# Altium schematic sheet 2_Power.SchDoc
size A; SheetNumber: 2; SheetTotal: 6
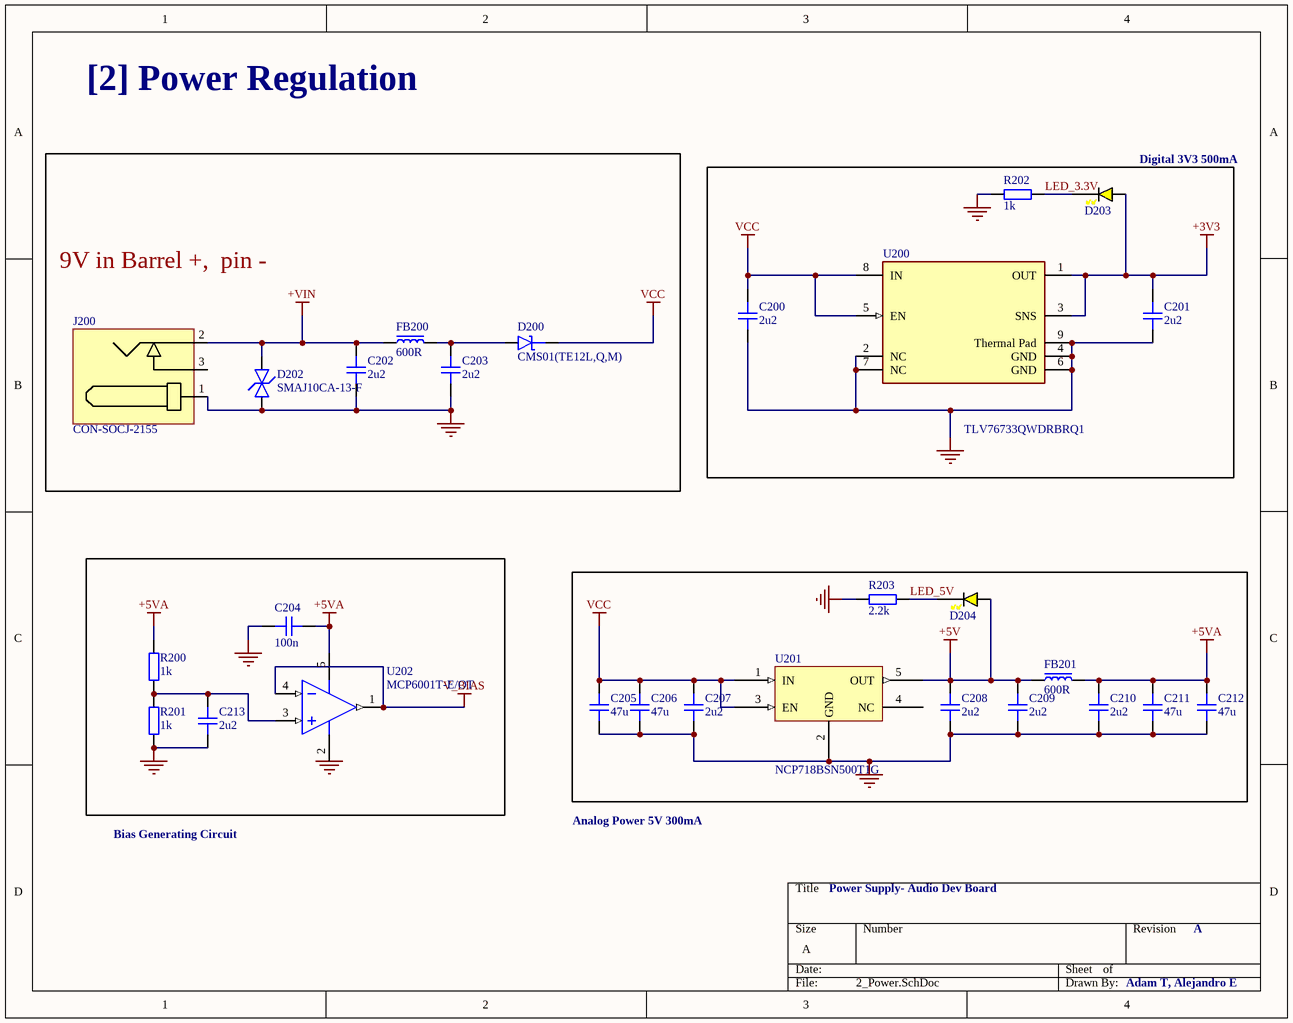
[diagram p0: 2_Power.SchDoc]

## Parts
C200  2u2  [CAP_0402]
C201  2u2  [CAP_0402]
C202  2u2  [CAP_0402]
C203  2u2  [CAP_0402]
C204  100n  [CAP_0402]
C205  47u  [CAP_1210]
C206  47u  [CAP_1210]
C207  2u2  [CAP_0402]
C208  2u2  [CAP_0402]
C209  2u2  [CAP_0402]
C210  2u2  [CAP_0402]
C211  47u  [CAP_1210]
C212  47u  [CAP_1210]
C213  2u2  [CAP_0402]
D200  CMS01(TE12L,Q,M)  [SOD_128]
D202  SMAJ10CA-13-F  [SMAJ10CA-13-F]
D203  YELLOW  [LED_0402_YELLOW]  (value not drawn)
D204  YELLOW  [LED_0402_YELLOW]  (value not drawn)
FB200  600R  [FB_0805]
FB201  600R  [FB_0805]
J200  CON-SOCJ-2155  [CON-SOCJ-2155]
R200  1k  [RES_0402]
R201  1k  [RES_0402]
R202  1k  [RES_0402]
R203  2.2k  [RES_0402]
U200  TLV76733QWDRBRQ1  [FP-DRB0008J-IPC_C]
U201  NCP718BSN500T1G  [TSOT25]
U202  MCP6001T-E/OT  [SOT-23-OT5_L]

## Blocks framed on the sheet
9V in Barrel +,  pin -: C202 C203 D200 D202 FB200 J200
Digital 3V3 500mA: C200 C201 D203 R202 U200

## Nets
+3V3: C201.2 D203.A U200.1(OUT) U200.3(SNS)
+5V: C208.2 C209.2 D204.A FB201.1 U201.5(OUT)
+5VA: C204.1 C210.2 C211.2 C212.2 FB201.2 R200.2 U202.5(VDD)
+VIN: C202.2 D202.K FB200.1 J200.2
GND: C200.1 C201.1 C202.1 C203.1 C204.2 C205.1 C206.1 C207.1 C208.1 C209.1 C210.1 C211.1 C212.1 C213.1 D202.A J200.1 R201.1 R202.1 R203.1 U200.2(NC) U200.4(GND) U200.6(GND) U200.7(NC) U200.9(Thermal_Pad) U201.2(GND) U202.2(VSS)
V_BIAS: U202.1(VOUT) U202.4(VIN-)
VCC: C200.2 C205.2 C206.2 C207.2 D200.K U200.5(EN) U200.8(IN) U201.1(IN) U201.3(EN)
LED_3.3V: D203.K R202.2
LED_5V: D204.K R203.2
NetC203_2: C203.2 D200.A FB200.2
NetC213_2: C213.2 R200.1 R201.2 U202.3(VIN+)

Not connected (* = marked no-connect by the designer): J200 3; U201 4(NC)

## Notes on the sheet
- [2] Power Regulation
- Bias Generating Circuit
- Analog Power 5V 300mA
- Power Supply- Audio Dev Board
- A
- Adam T, Alejandro E

## Library data of the parts
C200-C204 C207-C210 C213 = CAP_0402: Capacitor SMD 0402; Manufacturer: *; Manufacturer Part Number: *; Distributor Link: *; LCSC: *; Rating: *; Dielectric: *
C205 C206 C211 C212 = CAP_1210: Capacitor SMD 1210; Manufacturer: *; Manufacturer Part Number: *; Distributor Link: *; LCSC: *; Rating: *; Dielectric: *
D200 = D_SCHOTTKY_SOD_128: Diode 30 V 3A Surface Mount M-FLAT (2.4x3.8) / SOD-128
D202 = SMAJ10CA-13-F: TVS DIODE 10VWM 17VC SMA (DO-214AC)
D203 D204 = LED_0402_YELLOW: LED 0402 YELLOW SMD
FB200 FB201 = FB_0805: Ferrite Bead SMD 0805 C2982098; Manufacturer: *; Manufacturer Part Number: *; Distributor Link: *; LCSC: *
J200 = CON-SOCJ-2155: DC Barrell Jack 2.1mm 30V 2.5A THT; Manufacturer: Gravitech; Manufacturer Part Number: CON-SOCJ-2155
R200-R203 = RES_0402: Resistor SMD 0402
  R200 R201: Manufacturer: *; Manufacturer Part Number: *; Distributor Link: *; LCSC: *
U200 = CMP-04917-000370-1: IC OPAMP; RoHS Compliant: Yes
U201 = NCP718BSN500T1G: Linear Voltage Regulator IC Positive Fixed 1 Output 300mA TSOT-23-5
U202 = CMP-0187-00458-3: None; Output Current: 23mA; Number of Circuits: 1; Input Offset Voltage-Max: 4.5mV; Nominal Supply Current: 100uA; Min Supply Voltage: 1.8V; Voltage: 6V; Operating Supply Voltage: 5.5V; Gain Bandwidth Product: 1MHz; Amplifier Type: GENERAL PURPOSE; Voltage Gain: 112dB; Slew Rate: 0.6V/µs; Power Supply Rejection Ratio (PSRR): 86dB; Input Bias Current: 1pA; Common Mode Rejection Ratio: 60dB; Package Quantity: 3000; Lead Free: Lead Free; Case/Package: SOT-23; Max Operating Temperature: 125°C; RoHS Compliant: Yes; Radiation Hardening: No; Number of Channels: 1; Length: 3.1mm; Height: 1.3mm; Output Current per Channel: 23mA; Supply Current: 100uA; Packaging: Tape and Reel; Technology: CMOS; Number of Elements: 1; Number of Pins: 5; Input Offset Voltage (Vos): 4.5mV; Width: 1.8mm; Contact Plating: Tin; Mount: Surface Mount; Slew Rate-Nom: 0.6V/µs; Unity Gain Bandwidth Product: 1MHz; REACH SVHC: No SVHC; Number of Amplifiers: 1; Max Supply Voltage: 6V; Operating Supply Current: 100uA; Min Operating Temperature: -40°C; Bandwidth: 1MHz